# Altium schematic sheet DACֹֹ_Sources_REV2.SchDoc (part 2 of 2)
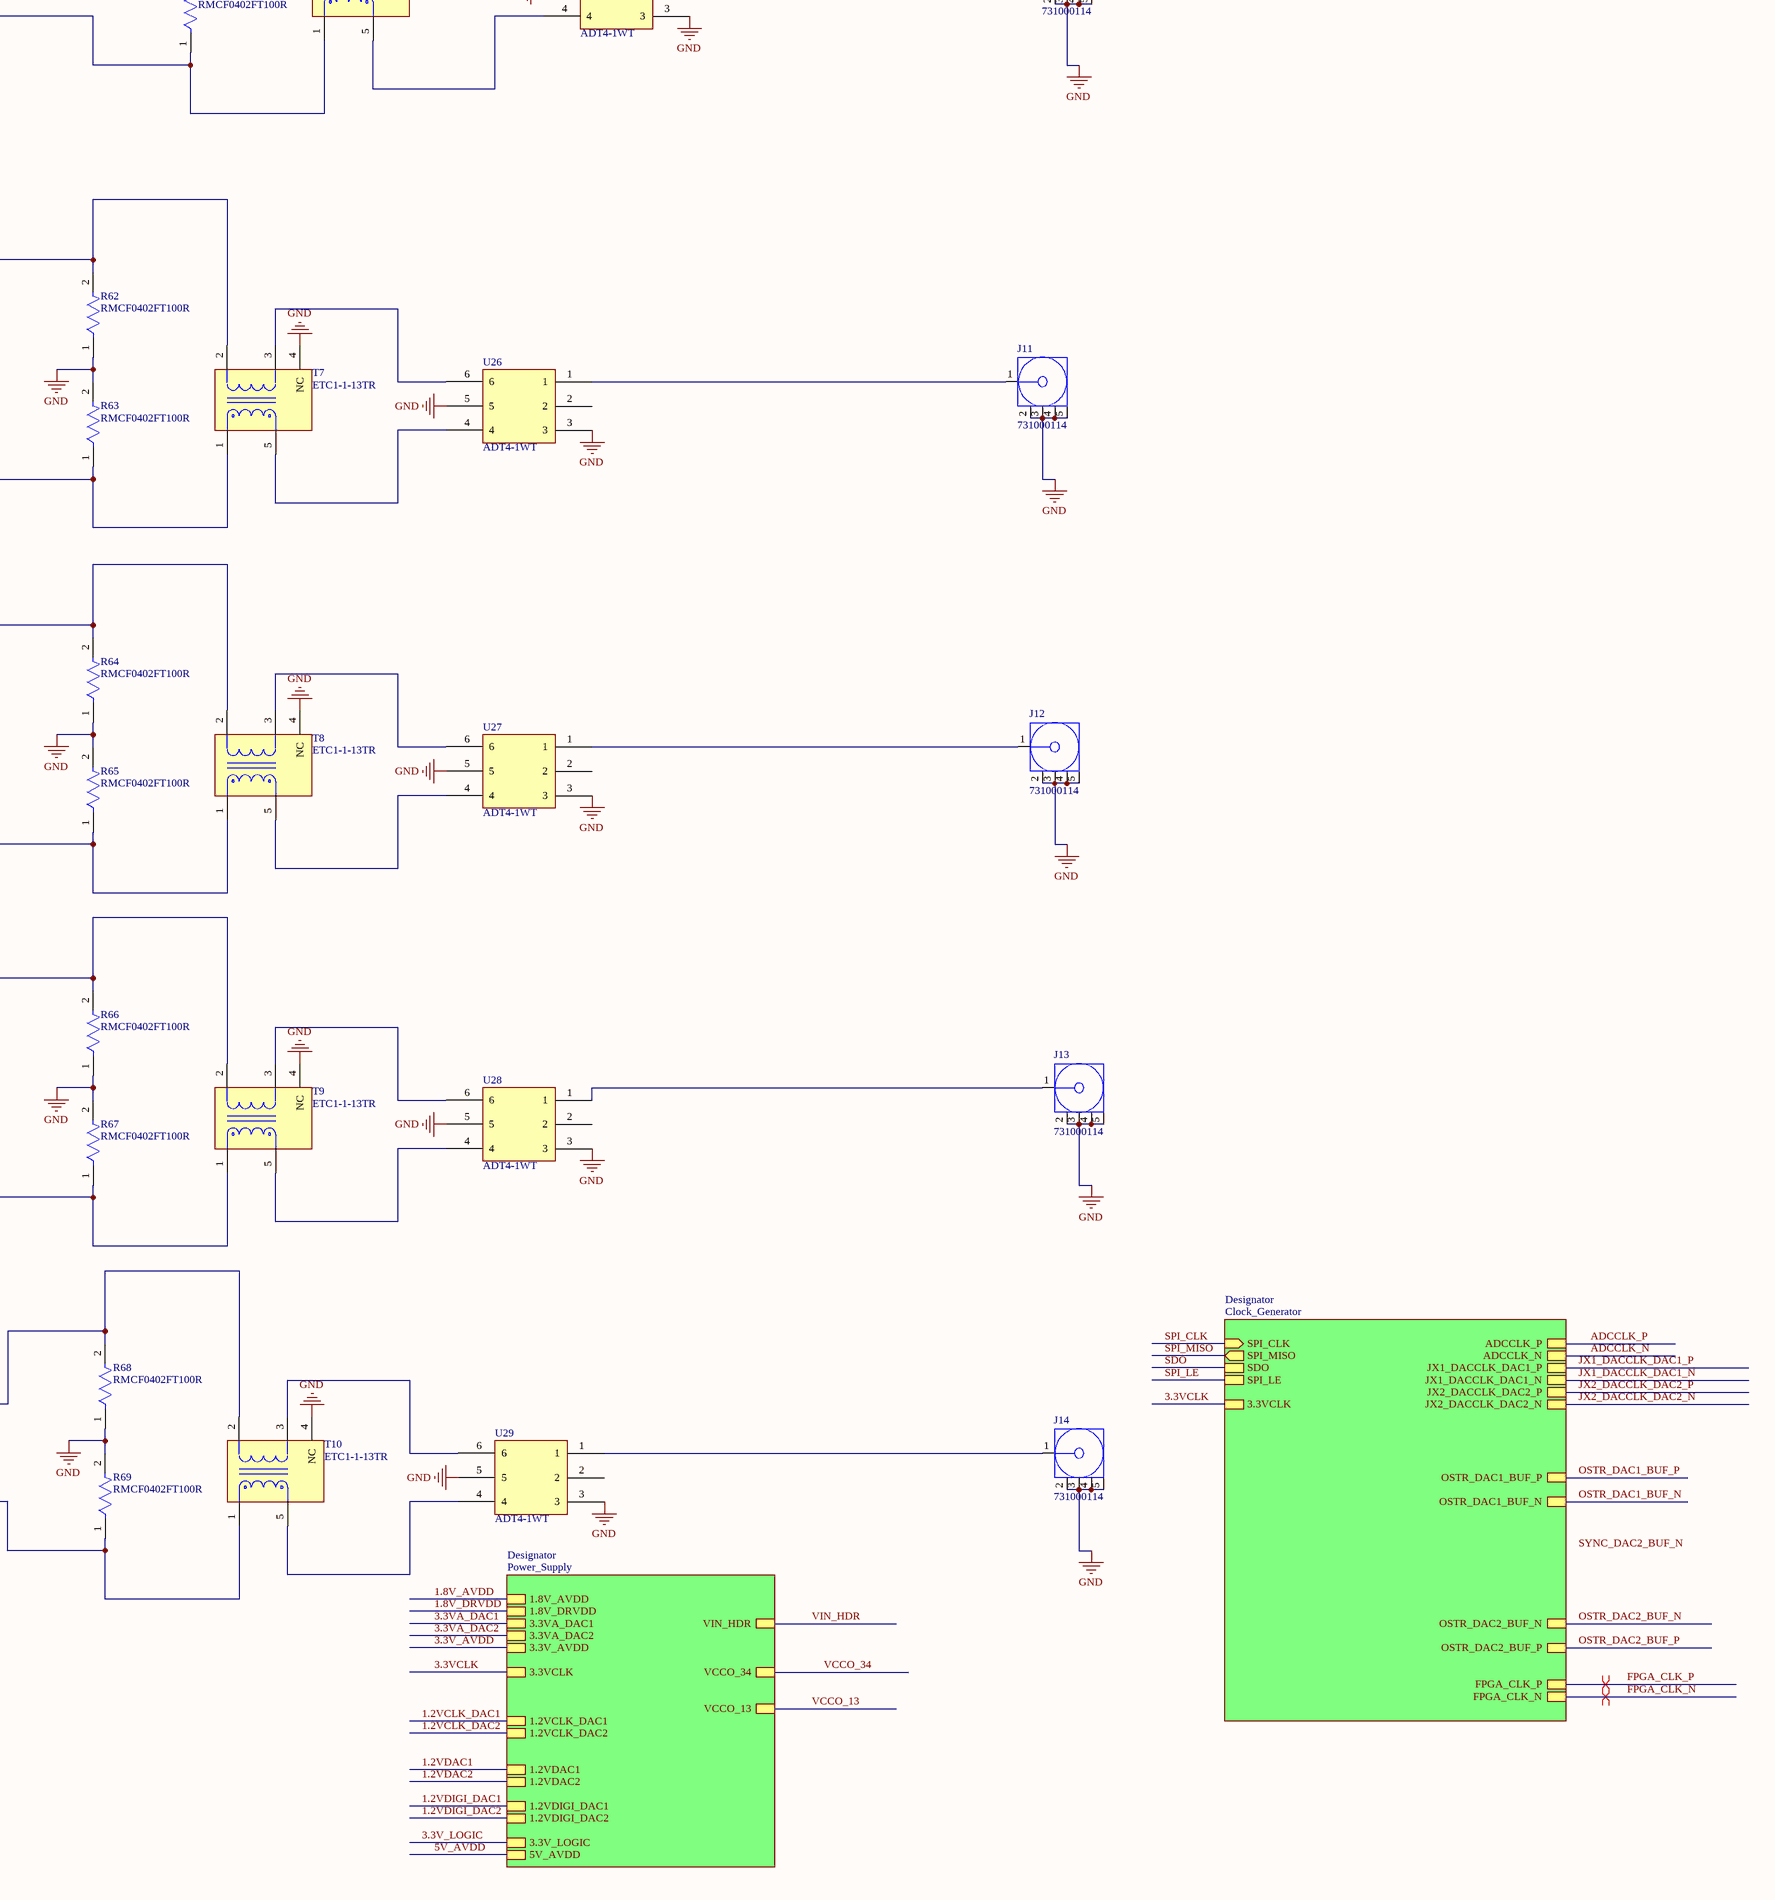
[diagram p6: DACֹֹ_Sources_REV2.SchDoc, bottom right]

## Library data of the parts
C1-C6 C10 C11 C19 C145-C150 C154-C159 C163-C168 C172-C177 C181-C186 C190-C195 C199-C201 = b4654b650e69147ec39a6b967a45e02: CAP CER 11PF 50V 5% NP0 0805; Manufacturer Part Number: C0805C110J5GACTU; Manufacturer: KEMET; Material: Ceramic; Tolerance: 0.05; Temperature Coefficient: 30ppm/°C; Temperature Characteristic: C0G; ComponentLink2URL: https://content.kemet.com/datasheets/KEM_C1003_C0G_SMD.pdf; Height: 0.88mm; Lead Free: Yes; Temperature Range High: +125°C; Mouser Description: Multilayer Ceramic Capacitors MLCC - SMD/SMT 50volts 11pF C0G 5%; Automotive: No; Temperature: -55°C to +125°C; Device Class L3: Ceramic Capacitors; Voltage Rating: 50 V; RoHS: TRUE; Value: 11 pF; Ipc Land Pattern Name: CAPC200125X78; Digikey Description: CAP CER 11PF 50V 5% NP0 0805; Capacitance: 11 pF; Temperature Range Low: -55°C; Device Class L2: Capacitors; ComponentLink2Description: Datasheet; Device Class L1: Passive Components; Category: Cap; Package: C0805C-DN; Octopart: https://octopart.com/c0805c110j5gactu-kemet-15514269
C7-C9 C142-C144 C151-C153 C160-C162 C169-C171 C178-C180 C187-C189 C196-C198 = 02cd4be3c70576c341d710602a673aa: Multi-Layer Ceramic Capacitor 3.3pF C0G  ±0.25pF 0402 Paper T/R; Voltage: 50V; Length: 1mm; Dielectric: C0G; Capacitance: 3.3pF; Case Code (Metric): 1005; Max Operating Temperature: 125°C; Min Operating Temperature: -55°C; Case/Package: 0402; Package Quantity: 1; Termination: SMD/SMT; Thickness: 0.022inch; Width: 0.5mm; Mount: Surface Mount; Voltage Rating (DC): 50V; Height: 0.5mm; Voltage Rating: 50V; Lead Free: Lead Free; Radiation Hardening: No; Case Code (Imperial): 0402; Depth: 0.5mm; Packaging: Tape and Reel
C78 C80 C81 C261 = b4654b650e69147ec39a6b967a45e02: 1206 C 15pF Ceramic Multilayer Capacitor; 50 VDC; +125degC; C0G Dielec; +/-5%; Manufacturer: KEMET; Tolerance: 0.05; Temperature Coefficient: 15%; Automotive Grade: Grade 0; Voltage Rating: 50 V; Temperature Range High: +150°C; Temperature Characteristic: C0G; Device Class L1: Passive Components; Automotive: Yes; Device Class L2: Capacitors; Digikey Description: 1206 C 15pF Ceramic Multilayer Capacitor; 50 VDC; +125degC; C0G Dielec; +/-5%; Height: 0.88mm; RoHS: TRUE; Package: C1206C-EB; Value: 15 pF; Temperature Range Low: -55°C; Mouser Description: Multilayer Ceramic Capacitors MLCC - SMD/SMT 50volts 15pF C0G 5%; Lead Free: Yes; ComponentLink2Description: Datasheet; Ipc Land Pattern Name: CAPC320160X78; Octopart: https://octopart.com/c1206c150j5gactu-kemet-138585; Temperature: -55°C to +150°C; Material: Ceramic; Capacitance: 15 pF; ComponentLink2URL: https://content.kemet.com/datasheets/KEM_C1007_X8R_ULTRA_150C_SMD.pdf; Device Class L3: Ceramic Capacitors; Manufacturer Part Number: C1206C150J5GACTU; Category: Cap
C79 C83 = 11868f565c42a9108669ba33697ecf6: CAP CER 5PF 100V NP0 0805; Manufacturer: KEMET; Tolerance: 0.05 pF; Temperature Coefficient: 30ppm/°C; Capacitance: 5.0 pF; Material: Ceramic; Value: 5.0 pF; Temperature Characteristic: C0G; Mouser Description: Multilayer Ceramic Capacitors MLCC - SMD/SMT 5pF 100volts; Height: 0.95mm; Temperature Range Low: -55°C; Lead Free: Yes; Digikey Description: CAP CER 5PF 100V NP0 0805; Package: CBR08C; Voltage Rating: 100 V; Octopart: https://octopart.com/cbr08c509a1gac-kemet-23801983; Ipc Land Pattern Name: CAPC200125X85; Temperature: -55°C to +125°C; Automotive: No; ComponentLink2Description: Datasheet; Device Class L1: Passive Components; Device Class L3: Ceramic Capacitors; ComponentLink2URL: https://content.kemet.com/datasheets/KEM_C1030_CBR_SMD.pdf; Temperature Range High: +125°C; Manufacturer Part Number: CBR08C509A1GAC; RoHS: TRUE; Category: Cap; Device Class L2: Capacitors
C202-C204 C206-C208 C219-C225 C227-C230 C232-C234 C236 C237 C240-C246 C248-C251 C253-C255 C257 C258 = b4654b650e69147ec39a6b967a45e02: None; Voltage Rating (DC): 10V; Capacitance: 220nF; Dielectric: X5R; Tolerance: 20%; Min Operating Temperature: -55°C; Halogen Free: Halogen Free; Termination: SMD/SMT; Case/Package: 0201; Case Code (Imperial): 0201; Thickness: 0.013inch; Width: 0.012inch; Packaging: Tape and Reel; Case Code (Metric): 0603; Height: 0.3mm; Resistor Type: Ceramic; Depth: 0.3mm; Mount: Surface Mount; Package Quantity: 15000; Voltage: 10V; Max Operating Temperature: 85°C; Radiation Hardening: No; RoHS Compliant: Yes; Voltage Rating: 10V; Series: M; Construction: Flat; Length: 0.6mm
C205 C209 C226 C231 C235 C238 C247 C252 C256 C259 = b4654b650e69147ec39a6b967a45e02: CAP CER 10UF 10V X5R 0603; Tolerance: 20%; Series: M; Case Code (Metric): 1608; Height: 0.8mm; Resistor Type: Ceramic; Length: 1.6mm; REACH SVHC: No SVHC; Package Quantity: 4000; Lead Free: Lead Free; Voltage Rating (DC): 10V; Thickness: 0.035inch; Width: 0.031inch; Max Operating Temperature: 85°C; Number of Pins: 2; RoHS Compliant: Yes; Voltage Rating: 10V; Case/Package: 0603; Termination: SMD/SMT; Min Operating Temperature: -55°C; Dielectric: X5R; Construction: Flat; Packaging: Tape and Reel; Mount: Surface Mount; Capacitance: 10uF; Case Code (Imperial): 0603
C210 C213 C214 C217 = b4654b650e69147ec39a6b967a45e02: Multilayer Ceramic Capacitors 1nF ±10% 25V X7R SMD 0402; Insulation Resistance: 10GR; Dissipation Factor: 3%; Max Operating Temperature: 125°C; Thickness: 0.022inch; Height: 0.5mm; Mount: Surface Mount; RoHS Compliant: Yes; Dielectric Material: Ceramic; Tolerance: 10%; Length: 0.039inch; Number of Pins: 2; Series: C; Voltage Rating (DC): 25V; Termination: SMD/SMT; Voltage Rating: 25V; Capacitance: 1nF; Packaging: Tape and Reel; Resistor Type: Ceramic; Width: 0.02inch; Case Code (Imperial): 0402; REACH SVHC: No SVHC; Dielectric: X7R; Min Operating Temperature: -55°C; Case Code (Metric): 1005; Lead Free: Lead Free; Case/Package: 0402; Weight: 2.3E-05oz; Depth: 0.5mm; Package Quantity: 1
C211 C212 C215 C216 C260 C263 C264 = b4654b650e69147ec39a6b967a45e02: Multilayer Ceramic Capacitors 100nF ±10% 16V X7R SMD 0402; Voltage: 16V; Depth: 0.5mm; Dielectric Material: Ceramic; Lead Free: Lead Free; Number of Pins: 2; Mount: Surface Mount; Radiation Hardening: No; Case/Package: 0402; Voltage Rating: 16V; Capacitance: 100nF; Dielectric: X7R; Min Operating Temperature: -55°C; RoHS Compliant: Yes; Tolerance: 10%; Voltage Rating (DC): 16V; Max Operating Temperature: 125°C; Case Code (Metric): 1005; Height: 0.5mm; Thickness: 0.022inch; Package Quantity: 1; Packaging: Tape and Reel; Termination: SMD/SMT; Construction: Flat; Resistor Type: Ceramic; Length: 1mm; Case Code (Imperial): 0402; Width: 0.02inch; Series: C; Weight: 2.3E-05oz
C218 C239 = b4654b650e69147ec39a6b967a45e02: None; Voltage Rating (DC): 10V; Dielectric: X5R; Capacitance: 100nF; Tolerance: 10%; Resistor Type: Ceramic; Max Operating Temperature: 85°C; Mount: Surface Mount; Package Quantity: 15000; Length: 0.6mm; RoHS Compliant: Yes; Case Code (Metric): 0603; Depth: 0.3mm; Halogen Free: Halogen Free; Case/Package: 0201; Series: M; Number of Pins: 2; Min Operating Temperature: -55°C; Radiation Hardening: No; Termination: SMD/SMT; Height: 0.3mm; Thickness: 0.013inch; Voltage Rating: 10V; Packaging: Tape and Reel; Width: 0.3mm; Contact Plating: Tin; Lead Free: Lead Free; Case Code (Imperial): 0201; Construction: Flat
C277-C279 C285-C287 C316-C323 = b4654b650e69147ec39a6b967a45e02: Multilayer Ceramic Capacitors 10nF ±10% 25V X7R SMD 0402; Dielectric Material: Ceramic; Case/Package: 0402; RoHS Compliant: Yes; REACH SVHC: No SVHC; Max Operating Temperature: 125°C; Package Quantity: 1; Capacitance: 10nF; Min Operating Temperature: -55°C; Width: 0.02inch; Radiation Hardening: No; Tolerance: 10%; Mount: Surface Mount; Series: C; Dielectric: X7R; Length: 1mm; Thickness: 0.022inch; Case Code (Imperial): 0402; Case Code (Metric): 1005; Resistor Type: Ceramic; Lead Free: Lead Free; Voltage: 25V; Packaging: Tape and Reel; Weight: 2.3E-05oz; Height: 0.5mm; Number of Pins: 2; Depth: 0.5mm; Voltage Rating (DC): 25V; Termination: SMD/SMT; Voltage Rating: 25V
C280 C288 = b4654b650e69147ec39a6b967a45e02: CAP CER 4.7UF 10V X5R 0603; Tolerance: 10%; Mount: Surface Mount; Weight: 7.1E-05oz; Case Code (Metric): 1608; Thickness: 0.022inch; Voltage Rating: 10V; Termination: SMD/SMT; Min Operating Temperature: -55°C; Package Quantity: 1; Case/Package: 0603; Capacitance: 4.7uF; RoHS Compliant: Yes; Packaging: Tape and Reel; Max Operating Temperature: 85°C; Width: 0.031inch; Series: CGB; Height: 0.55mm; Dielectric: X5R; Depth: 0.8mm; Case Code (Imperial): 0603; Length: 1.6mm; Lead Free: Lead Free; Voltage Rating (DC): 10V
C283 C284 = 11868f565c42a9108669ba33697ecf6: CAP CER 10000PF 50V X7R 0603; Manufacturer: YAGEO; Tolerance: 0.1; Material: Ceramic; Temperature Coefficient: 15%; Value: 10 nF; Mouser Description: Multilayer Ceramic Capacitor, CC Series, 0.01 - F, - 10%, X7R, 50 V, 0603 [1608 Metric]; Digikey Description: CAP CER 10000PF 50V X7R 0603; Height: 0.9mm; Category: Cap; Temperature Characteristic: X7R; Footprint Url: http://www.yageo.com/exep/pages/download/literatures/UPY-C_GEN_24.pdf; Lead Free: Yes; Voltage Rating: 50 V; Manufacturer Part Number: CC0603KRX7R9BB103; Temperature: -55°C to +125°C; Device Class L3: Ceramic Capacitors; ComponentLink2Description: Datasheet; Voltage: 50 V; Package: CC0603-DA; Octopart: https://octopart.com/cc0603krx7r9bb103-yageo-192938; Automotive: No; Temperature Range High: +125°C; Temperature Range Low: -55°C; RoHS: TRUE; Device Class L1: Passive Components; ComponentLink2URL: http://www.yageo.com/documents/recent/UPY-GPHC_X7R_6.3V-to-50V_18.pdf; Device Class L2: Capacitors; Capacitance: 10 nF
FB11 FB18 = 5f30dd21d616792df468990f7003faa: Chip Ferrite Bead, 0603, 1500Ω @ 100MHz, 0.5Ω, 25%, 500mA; Impedance: 1.5kR; DC Resistance (DCR): 500mR; Number of Circuits: 1; Test Frequency: 100MHz; Case/Package: 0603; Max Operating Temperature: 125°C; Package Quantity: 1; Max DC Current: 500mA; Tolerance: 25%; Core Material: Ferrite; Width: 0.8mm; Number of Pins: 2; Depth: 0.8mm; Radiation Hardening: No; Case Code (Imperial): 0603; Min Operating Temperature: -55°C; Termination: SMD/SMT; Material: Ferrite; Military Standard: Not; Number of Lines: 1; DC Current: 500mA; Length: 1.6mm; REACH SVHC: No SVHC; Lead Free: Lead Free; Current Rating: 500mA; Max Current Rating: 500mA; Packaging: Tape and Reel; Case Code (Metric): 1608; Height: 0.8mm
FB17 FB19 = 5f30dd21d616792df468990f7003faa: Ferrite Bead, 1806, 1000Ω @ 100MHz, 25%, 0.09Ω, 1.5A; Manufacturer Series: BLM41P; Number of Lines: 1; DC Resistance (DCR): 90mR; Material: Steel; Impedance: 1kR; Shielding: Unshielded; Case Code (Metric): 4516; REACH SVHC: No SVHC; Case/Package: 1806; Core Material: Ferrite; Max Operating Temperature: 125°C; Terminal Finish: Tin; Radiation Hardening: No; Termination: SMD/SMT; DC Current: 1.5A; Current Rating: 1.5A; Tolerance: 25%; Frequency: 100MHz; Number of Pins: 2; DC Resistance-Max: 90mR; Series: BLM41P; Min Operating Temperature: -55°C; Length: 4.5mm; Number of Circuits: 1; Case Code (Imperial): 1806; Width: 1.6mm; Number of Functions: 1; Military Standard: Not; Packaging: Tape and Reel; Lead Free: Lead Free; Max DC Current: 1.5A; Package Quantity: 1; Max Current Rating: 1.5A; Depth: 1.6mm; Test Frequency: 100MHz; Height: 1.6mm
FB22 FB23 = 5f30dd21d616792df468990f7003faa: Chip Ferrite Bead, 0402, 120Ω @ 100MHz, 0.09Ω, 25%, 1.3A; Impedance: 120R; Material: Steel; Number of Lines: 1; DC Resistance (DCR): 90mR; Number of Pins: 2; Military Standard: Not; Width: 0.5mm; Depth: 0.55mm; Lead Free: Lead Free; Test Frequency: 100MHz; Case Code (Metric): 1005; Case Code (Imperial): 0402; Current Rating: 1.3A; Package Quantity: 1; Height: 0.5mm; Radiation Hardening: No; Tolerance: 25%; Max DC Current: 1.3A; Packaging: Tape and Reel; REACH SVHC: No SVHC; Case/Package: 0402; Min Operating Temperature: -55°C; Max Current Rating: 1.3A; Length: 1mm; Number of Circuits: 1; Core Material: Ferrite; Max Operating Temperature: 125°C; Termination: SMD/SMT; DC Current: 1.3A
J1 J2 = 61083-104400LF: Conn Fine Pitch Connector PL 100 POS 0.8mm Solder ST Top Entry SMD BergstakÂ® Tube; MF: Amphenol; Package: None; Price: None; Check_prices: https://www.snapeda.com/parts/61083-104400LF/Amphenol/view-part/?ref=eda; Value: *; SnapEDA_Link: https://www.snapeda.com/parts/61083-104400LF/Amphenol/view-part/?ref=snap; MP: 61083-104400LF; Availability: In Stock; Purchase-URL: https://pricing.snapeda.com/search/part/61083-104400LF/?ref=eda
J4 J8-J18 = CN-S-4F-RF5: SMA Right-Angle PCB Jack Receptacle, Brass Body, Gold Plated, 50 Ohm, 5-Pin THD, RoHS, Tray; Manufacturer: Molex; Datasheet Version: 09/2016; Package Description: 5-Pin Through Hole Device, Body 14.8 x 6.35 mm, Pitch 2.54 mm; Datasheet URL: http://www.molex.com/webdocs/datasheets/pdf/en-us/0731000114_RF_COAX_CONNECTORS.pdf; Manufacturer URL: http://www.molex.com/; Package Reference: 731000114; Mounting Technology: ThroughHole; Package URL: http://www.molex.com/pdm_docs/sd/731000114_sd.pdf
L6 L9 L10 L13 L14 L17 L18 L21 L22 L25 L26 L29 L30 L33 L34 L37 L38 L41 L42 L45 L46 L49 L50 L53 L54 L57 L58 L61 L62 L65 L66 L69 = Inductor Iron: Published: 24-Mar-1999; LatestRevisionDate: 17-Jul-2002; LatestRevisionNote: Re-released for DXP Platform.; PackageReference: AXIAL-0.9; Publisher: Altium Limited; PackageDescription: Axial Device, Thru-Hole; 2 Leads; 0.9 in Pin Spacing
L7 L8 L11 L12 L15 L16 L19 L20 L23 L24 L27 L28 L31 L32 L35 L36 L39 L40 L43 L44 L47 L48 L51 L52 L55 L56 L59 L60 L63 L64 L67 L68 = Inductor Iron: 0805HP  33nH; Published: 24-Mar-1999; LatestRevisionDate: 17-Jul-2002; LatestRevisionNote: Re-released for DXP Platform.; PackageReference: AXIAL-0.9; Publisher: Altium Limited; PackageDescription: Axial Device, Thru-Hole; 2 Leads; 0.9 in Pin Spacing
P1 = Header 10X2: Header, 10-Pin, Dual row; LatestRevisionDate: 17-Jul-2002; LatestRevisionNote: Re-released for DXP Platform.; Publisher: Altium Limited
P3-P6 P11 P12 P16 P17 = Header 3: Header, 3-Pin; LatestRevisionDate: 17-Jul-2002; LatestRevisionNote: Re-released for DXP Platform.; Publisher: Altium Limited
P10 = Header 4X2: Header, 4-Pin, Dual row; LatestRevisionDate: 17-Jul-2002; LatestRevisionNote: Re-released for DXP Platform.; Publisher: Altium Limited
R1 R7 R10-R12 R59-R69 = 1029c3af85768c4190bb7ad29bc67b5: 100Ω ±1% 0.063W 0402 Thick Film Chip Resistor AEC-Q200 compliant; Power Rating: 62.5mW; Temperature Coefficient: 100ppm/°C; Max Power Dissipation: 63mW; Resistance: 100R; Min Operating Temperature: -55°C; Packaging: Tape and Reel; Tolerance: 1%; Military Standard: Not; Number of Terminations: 2; RoHS Compliant: Yes; Length: 1mm; Max Operating Temperature: 155°C; Width: 0.02inch; Case Code (Imperial): 0402; Case/Package: 0402; Contact Plating: Tin; Depth: 0.5mm; Height: 0.016inch; Case Code (Metric): 1005; Mount: Surface Mount; Construction: Rectangular; Lead Free: Lead Free; Resistor Type: Thick Film; Series: RMCF; Features: Automotive AEC-Q200
R2-R6 R8 R13-R22 R72 R77 R99 R100 = RES: Manufacturer: Vishay Dale
  R2-R6 R8 R13-R22: Part Number: CRCW020149R9FKED
  R72 R77: Part Number: CRCW040210R0FKED
  R99 R100: Part Number: CRCW060349R9FKEA
R9 R46 R82 R130 R147 = 1029c3af85768c4190bb7ad29bc67b5: RES 33Ω ±1% 0.063W 0402; Voltage Rating: 50V; Power Rating: 62.5mW; Resistance: 33R; Temperature Coefficient: 100ppm/°C; Max Power Dissipation: 63mW; Case/Package: 0402; Lead Free: Lead Free; Width: 0.5mm; Military Standard: Not; Length: 0.039inch; Termination: SMD/SMT; Depth: 0.5mm; Height: 0.015inch; Tolerance: 1%; RoHS Compliant: Yes; Case Code (Metric): 1005; Number of Terminations: 2; Size Code: 0402; Case Code (Imperial): 0402; Min Operating Temperature: -55°C; Series: AC; Mount: Surface Mount; Packaging: Tape and Reel; Weight: 2.3E-05oz; Features: Moisture Resistant; Max Operating Temperature: 155°C; Resistor Type: Thick Film; Construction: Rectangular
R45 R47 R129 R131 = 1029c3af85768c4190bb7ad29bc67b5: RES 15Ω ±1% 0.063W 0402; Max Power Dissipation: 63mW; Temperature Coefficient: 100ppm/°C; Resistance: 15R; Min Operating Temperature: -55°C; Packaging: Cut Tape; Series: AC; Resistor Type: Thick Film; Features: Moisture Resistant; Height: 0.015inch; Length: 0.039inch; Number of Terminations: 2; Case/Package: 0402; Width: 0.02inch; RoHS Compliant: Yes; Max Operating Temperature: 155°C; Case Code (Metric): 1005; Tolerance: 1%; Case Code (Imperial): 0402
R48 R132 = 1029c3af85768c4190bb7ad29bc67b5: RES 120Ω ±1% 0.063W 0402; Max Power Dissipation: 63mW; Resistance: 120R; Power Rating: 62.5mW; Temperature Coefficient: 100ppm/°C; Voltage Rating: 50V; Case Code (Imperial): 0402; Height: 0.015inch; RoHS Compliant: Yes; Resistor Type: Thick Film; Width: 0.5mm; Min Operating Temperature: -55°C; Features: Moisture Resistant; Series: AC; Case Code (Metric): 1005; Packaging: Tape and Reel; Length: 0.039inch; Termination: SMD/SMT; Max Operating Temperature: 155°C; Case/Package: 0402; Number of Terminations: 2; Tolerance: 1%
R49 R146 = 1029c3af85768c4190bb7ad29bc67b5: RES 76.8Ω ±1% 0.063W 0402; RoHS Compliant: Yes
R50 R81 R134 R145 = 1029c3af85768c4190bb7ad29bc67b5: RES 200Ω ±1% 0.063W 0402; Max Power Dissipation: 63mW; Temperature Coefficient: 100ppm/°C; Resistance: 200R; Series: AC; Max Operating Temperature: 155°C; Packaging: Cut Tape; Case Code (Imperial): 0402; Case/Package: 0402; Length: 0.039inch; Power Rating: 63mW; Min Operating Temperature: -55°C; Height: 0.015inch; Size Code: 0402; Case Code (Metric): 1005; Tolerance: 1%; Resistor Type: Thick Film; Lead Free: Lead Free; Features: Moisture Resistant; RoHS Compliant: Yes; Number of Terminations: 2; Width: 0.02inch
R70 R73 R75 R78 = RES-2: Chip Resistor, 1 KOhm, +/- 1%, 100 mW, -55 to 155 degC, 0402 (1005 Metric), RoHS, Tape and Reel; Manufacturer: Basic Passives; Voltage Rating: 50 V; Case\/Package: 0402; Resistance: 1 KOhm; Power Rating: 100 mW; PartNumber: ERJ-2RKF1001X; DatasheetVersion: 04/2015; Radiation Hardening: No; Pins: 2; Height: 0.35 mm; RoHSCompliant: true; Case Code (Imperial): 0402; ComponentLink2Description: Datasheet; ComponentLink1Description: Manufacturer URL; PackageReference: 0402; Mount: Surface Mount; Package Quantity: 10000; Tolerance: 1%; ComponentLink1URL: http://www.panasonic.com/; PackageDescription: 2-Pin Surface Mount Device, Body 1 x 0.5 mm; Mounting Technology: Surface Mount; Case Code (Metric): 1005; ComponentLink2URL: http://industrial.panasonic.com/cdbs/www-data/pdf/RDA0000/AOA0000C86.pdf; REACH SVHC: Yes; Packaging: Tape and Reel; Max Operating Temperature: 155 degC; Min Operating Temperature: -55 degC; Width: 0.5 mm; Length: 1 mm
R71 R76 = RES: Manufacturer: Panasonic; Part Number: ERJ-2RKF1271X
R74 R79 R127 R128 = RES-2: Chip Resistor, 0 Ohm, 0.1 W, -55 to 155 degC, 0402 (1005 Metric), RoHS, Tape and Reel; Manufacturer: Panasonic; Voltage Rating (DC): 50V; Temperature Coefficient: 600ppm/��C; Max Power Dissipation: 100mW; Resistance: 0mOhm; Tolerance: 5%; Number of Terminations: 2; Mount: SurfaceMount; Height: 0.35mm; Packaging: TapeandReel; Contact Plating: Tin; Manufacturer URL: http://www.panasonic.com/; Composition: ThickFilm; Max Operating Temperature: 155degC; REACH SVHC: NoSVHC; Case/Package: 0402; Package Reference: 402; Depth: 0.5mm; Package Description: 2-Pin Surface Mount Device, Body 1 x 0.5 mm; Datasheet URL: https://industrial.panasonic.com/cdbs/www-data/pdf/RDA0000/AOA0000C301.pdf; RoHSCompliant: True; Case Code (Imperial): 0402; Military Standard: Not; Min Operating Temperature: -55degC; Power Rating: 100mW; Datasheet Version: 03/2015; Length: 1mm; Case Code (Metric): 1005; Termination: SMD/SMT; Mounting Technology: SurfaceMount; Voltage Rating: 50V; Width: 0.02inch; Package Quantity: 1; Lead Free: LeadFree; Radiation Hardening: No
R80 R133 = 1029c3af85768c4190bb7ad29bc67b5: RES 91Ω ±1% 0.063W 0402; Resistance: 91R; Temperature Coefficient: 100ppm/°C; Max Power Dissipation: 63mW; Max Operating Temperature: 155°C; RoHS Compliant: Yes; Series: AC; Resistor Type: Thick Film; Packaging: Tape and Reel; Case/Package: 0402; Length: 0.039inch; Features: Moisture Resistant; Number of Terminations: 2; Width: 0.02inch; Height: 0.015inch; Min Operating Temperature: -55°C; Tolerance: 1%
R83 R111 R120 R121 = CMP-1011-00397-3: RES Thick Film, 100Ω, 1%, 0.063W, 100ppm/°C, 0402; Max Power Dissipation: 63mW; Voltage Rating: 50V; Resistance: 100R; Package Quantity: 10; Lead Free: Lead Free; Termination: SMD/SMT; Case Code (Metric): 1005; Number of Terminations: 2; Composition: Thick Film; Voltage Rating (DC): 50V; Min Operating Temperature: -55°C; Case/Package: 0402; Radiation Hardening: No; Max Operating Temperature: 155°C; Temperature Coefficient: 100ppm/°C; Military Standard: Not; Length: 1mm; Mount: Surface Mount; Power Rating: 63mW; Weight: 2.3E-05oz; Working Voltage: 50V; Features: Automotive AEC-Q200; Depth: 0.5mm; Packaging: Tape and Reel; Tolerance: 1%; Height: 0.35mm; Case Code (Imperial): 0402; Width: 0.02inch; Contact Plating: Tin
R101-R104 = 1029c3af85768c4190bb7ad29bc67b5: RES Thick Film, 100Ω, 5%, 0.1W, 200ppm/°C, 0603; Power Rating: 100mW; Voltage Rating: 75V; Resistance: 100R; Weight: 7.1E-05oz; Max Operating Temperature: 155°C; Military Standard: Not; Case Code (Imperial): 0603; Case/Package: 0603; Packaging: Tape and Reel; Number of Terminations: 2; Package Quantity: 1; Radiation Hardening: No; Termination: SMD/SMT; Case Code (Metric): 1608; Min Operating Temperature: -55°C; Height: 0.02inch; Length: 1.55mm; Tolerance: 5%; Width: 0.85mm; Contact Plating: Tin; Max Power Dissipation: 100mW; Features: Automotive AEC-Q200; Composition: Thick Film; Temperature Coefficient: 200ppm/°C; Depth: 0.85mm
R135-R144 R148-R152 R? = RES: Manufacturer: Yageo / Phycomp; Part Number: RC0402JR-070RL
RN3-RN6 U22-U29 = Component_1
SW1 SW2 = a6a22157dac91622554311b1edc5dcf: SWITCH TACTILE SPST-NO 1VA 32V; Manufacturer: C&K Components; Operating Force: 300gf; Standoff Height: 0.14mm; Electromechanical Life: 100000Cycles; Contact Resistance: 50mΩ; Throw Configuration: SPST-NO; Temperature: -40°C to +90°C; Mount: Surface Mount; Voltage Rating Dc: 32V; Automotive: No; Category: Switch; RoHS: TRUE; Mouser Description: Tactile Switches 1.12Mm Silvr J-Lead; Height: 4.1mm; Device Class L2: Switches; Voltage Rating Ac: 32V; Lead Free: Yes; Digikey Description: SWITCH TACTILE SPST-NO 1VA 32V; Temperature Range Low: -40°C; Manufacturer Part Number: KT11P3JM34LFS; ComponentLink2URL: https://dznh3ojzb2azq.cloudfront.net/products/Tactile/KT/documents/datasheet.pdf; Package: 0; Octopart: https://octopart.com/kt11p3jm34lfs-c%26k+components-55425764; ComponentLink2Description: Datasheet; Device Class L3: Tactile Switches; Temperature Range High: +90°C; Device Class L1: Electromechanical
T1 T4-T10 = 4f5dfae470883114705f86a4213dd5e: BALUN 4.5MHZ-3GHZ 1:1 5SMD; Manufacturer: MA-COM; Insertion Loss: 3.5dB; Bandwidth: 2995.5MHz; Frequency: 4.5-3000MHz; Temperature: -55°C to +85°C; RoHS: TRUE; Category: Trans; Temperature Range Low: -55°C; Device Class L2: EMI / RFI Components; Digikey Description: BALUN 4.5MHZ-3GHZ 1:1 5SMD; Lead Free: Yes; Octopart: https://octopart.com/etc1-1-13tr-ma-com-7863633; Device Class L1: Passive Components; Automotive: No; Mouser Description: RF Transformer 1: 1 5 Terminal SMD; ComponentLink2URL: http://cdn.macom.com/datasheets/ETC1-1-13.pdf; Manufacturer Part Number: ETC1-1-13TR; Height: 2.95mm; ComponentLink2Description: Datasheet; Device Class L3: RF; Temperature Range High: +85°C; Package: ETC1-1-13TR
TP5-TP8 = TESTPOINT_RED: Test Point, Red, Through Hole, RoHS, Bulk; Manufacturer: Keystone; Contact Material: Bronze; Mounting Technology: Through Hole; RoHSCompliant: true; Pins: 1; Package Quantity: 100; ComponentLink2Description: Datasheet; Height: 8.12 mm; ComponentLink1URL: http://www.keyelco.com/; DatasheetVersion: Rev. F, 12/2013; Mount: Through Hole; PackageReference: 5010; Contact Plating: Silver; Packaging: Bulk; Colour: Red; REACH SVHC: No SVHC; PackageDescription: 1-Pin Through Hole Device, Dia 3.17 mm; ComponentLink2URL: http://www.keyelco.com/product-pdf.cfm?p=1319; ComponentLink1Description: Manufacturer URL
U1 U6 = TI-DAC348XRKD88-6300X6300TP: 4-Channel 16-Bit 1.25 GSPS DAC, -40 to 85 degC, 88-pin QFN (RKD88), Green (RoHS & no Sb/Br); Manufacturer: Texas Instruments; SFDR(dB): 82; Resolution(Bits): 16; Settling Time(us): 0.01; Interface: Parallel LVDS; Power Consumption(Typ)(mW): 1270; DAC Channels: 4; SubFamily: High Speed DAC (>10MSPS); PackageDescription: 88-Pin Plastic Quad Flatpack No-Lead, Body 9 x 9 mm, Pitch 0.6 mm; Eco-Plan: Green (RoHS & no Sb/Br); ComponentLink2URL: http://www.ti.com/general/docs/lit/getliterature.tsp?genericPartNumber=DAC3484&fileType=pdf; DatasheetVersion: SLAS749C; ComponentLink3URL: http://www.ti.com/litv/pdf/mpqf242; PackageReference: RKD88-6300X6300TP; ComponentLink3Description: Package Specification; ComponentLink2Description: Datasheet; Mounting Technology: Surface Mount; PartNumber: DAC3484IRKDT; ComponentLink1URL: http://www.ti.com/; PackageVersion: 4210251/A, 04/2009; ComponentLink1Description: Manufacturer URL
U3 = fefbec2708a79eb2d27bfd4b915d167: IC OPAMP DIFF 2 CIRCUIT 24LFCSP; Output Current per Channel: 30mA; Number of Circuits: 2; -3db Bandwidth: 1.35GHz; Amplifier Type: DIFFERENTIAL; Max Supply Voltage: 5.5V; Bandwidth: 1.43GHz; Voltage Gain: 64dB; Input Offset Voltage (Vos): 150uV; Slew Rate: 3400V/µs; Power Supply Rejection Ratio (PSRR): 71dB; Input Resistance: 3MR; Input Bias Current: 23uA; Common Mode Rejection Ratio: 77dB; Operating Supply Current: 34mA; Case/Package: LFCSP EP; Number of Elements: 2; Package Quantity: 1; Min Operating Temperature: -40°C; Mount: Surface Mount; RoHS Compliant: Yes; Number of Amplifiers: 2; Packaging: Tape and Reel; Max Operating Temperature: 105°C; Number of Pins: 24; Series: -; Lead Free: Contains Lead; REACH SVHC: No SVHC; Number of Channels: 2; Contact Plating: Tin
U5 = 599d8c5e20d6343fb63873f0ba23ec7: IC CLK BUFFER DVR 1:2 12MSOP; Max Supply Voltage: 3.45V; Operating Supply Voltage: 3.3V; Min Supply Voltage: 3.15V; Propagation Delay: 4.4ns; Number of Outputs: 2; Number of Pins: 12; Case/Package: MSOP; Radiation Hardening: No; Max Operating Temperature: 125°C; RoHS Compliant: Yes; Min Operating Temperature: -40°C; Mount: Surface Mount
U7 = AD9643BCPZ-250: 14-Bit, 170 MSPS/210 MSPS/250 MSPS, 1.8 V Dual Analog-to-Digital Converter (ADC); Manufacturer_Name: Analog Devices Inc; Manufacturer_Part_Number: AD9643BCPZ-250; Type: Type; Copyright: Copyright (C) 2025 Ultra Librarian. All rights reserved.; Design Item ID: AD9643BCPZ-250; Source: AD9643BCPZ-250.SchLib; RefDes: RefDes
U30 = 30cb43c013c66b9f7606d7aff426576: IC REDRIVER LVDS 1CH 8SOIC; Data Rate: 800Mbps; Logic Function: Buffer; Max Supply Current: 70mA; Min Input Voltage: -100mV; Max Input Voltage: 100mV; Number of Receivers: 1; Max Output Voltage: 450mV; Max Power Dissipation: 726mW; Propagation Delay: 2ns; Power Consumption: 155W; Min Supply Voltage: 3V; Operating Supply Voltage: 3.3V; Max Input Current: 10uA; Max Supply Voltage: 3.6V; Contact Plating: Tin; Length: 4.9mm; Series: DS90LV001; Lead Free: Lead Free; Min Operating Temperature: -40°C; Max Operating Temperature: 85°C; Case/Package: SOIC; Number of Elements: 1; Height: 1.45mm; Number of Drivers: 1; Number of Channels: 1; Operating Supply Current: 70mA; Weight: 0.005044oz; RoHS Compliant: Yes; Power Dissipation: 726mW; Mount: Surface Mount; Turn-On Delay Time: 2ns; Package Quantity: 2500; Width: 3.9mm; Number of Pins: 8; Packaging: Tape and Reel; Radiation Hardening: No